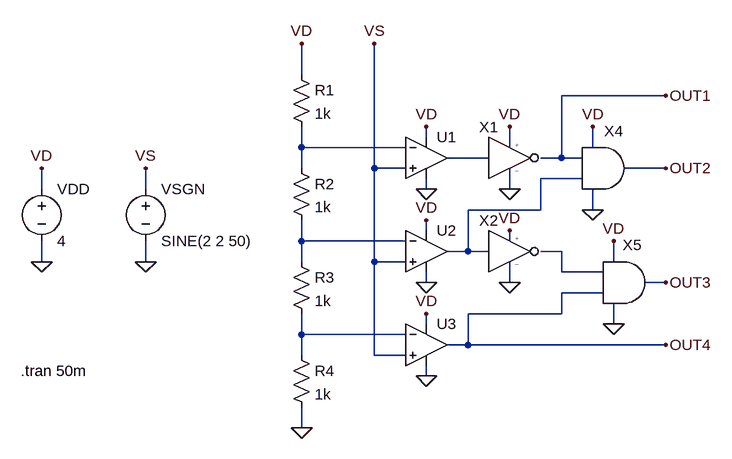
[diagram p0: schematic ADC_2b_Flash.asc]
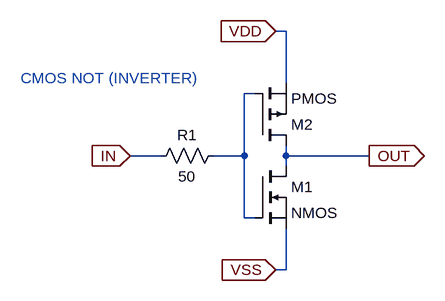
[diagram p1: sub-circuit not.asc]
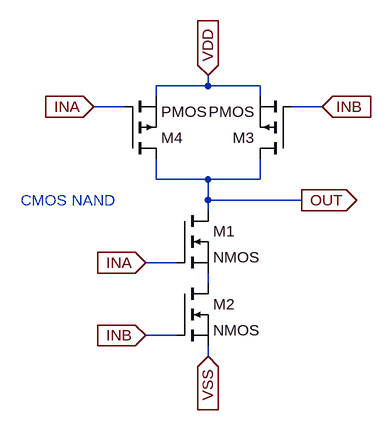
[diagram p2: sub-circuit nand.asc]
ADC_2b_Flash.asc, the LTspice schematic file:
Version 4
SHEET 1 1000 680
WIRE 112 96 112 48
WIRE 672 128 512 128
WIRE 304 192 304 176
WIRE 112 208 112 176
WIRE 272 208 112 208
WIRE 432 208 432 176
WIRE 560 208 560 176
WIRE 400 224 336 224
WIRE 512 224 512 128
WIRE 512 224 480 224
WIRE 544 224 512 224
WIRE 112 240 112 208
WIRE 224 240 224 48
WIRE 272 240 224 240
WIRE 672 240 608 240
WIRE 544 256 480 256
WIRE -288 272 -288 240
WIRE -128 272 -128 240
WIRE 304 272 304 256
WIRE 432 272 432 240
WIRE 480 304 480 256
WIRE 480 304 368 304
WIRE 560 304 560 272
WIRE 304 336 304 320
WIRE 112 352 112 320
WIRE 272 352 112 352
WIRE 432 352 432 336
WIRE 368 368 368 304
WIRE 368 368 336 368
WIRE 400 368 368 368
WIRE 512 368 480 368
WIRE -288 384 -288 352
WIRE -128 384 -128 352
WIRE 112 384 112 352
WIRE 224 384 224 240
WIRE 272 384 224 384
WIRE 592 384 592 352
WIRE 512 400 512 368
WIRE 576 400 512 400
WIRE 304 416 304 400
WIRE 432 416 432 384
WIRE 672 416 640 416
WIRE 576 432 512 432
WIRE 512 464 512 432
WIRE 512 464 368 464
WIRE 304 480 304 464
WIRE 592 480 592 448
WIRE 112 496 112 464
WIRE 272 496 112 496
WIRE 368 512 368 464
WIRE 368 512 336 512
WIRE 672 512 368 512
WIRE 112 528 112 496
WIRE 224 528 224 384
WIRE 272 528 224 528
WIRE 304 560 304 544
WIRE 112 640 112 608
FLAG 112 48 VD
FLAG 112 640 0
FLAG -288 240 VD
FLAG -128 240 VS
FLAG -288 384 0
FLAG -128 384 0
FLAG 672 240 OUT2
FLAG 672 128 OUT1
FLAG 672 512 OUT4
FLAG 672 416 OUT3
FLAG 224 48 VS
FLAG 304 176 VD
FLAG 304 320 VD
FLAG 304 464 VD
FLAG 304 272 0
FLAG 304 560 0
FLAG 304 416 0
FLAG 432 176 VD
FLAG 432 336 VD
FLAG 560 176 VD
FLAG 592 352 VD
FLAG 432 272 0
FLAG 432 416 0
FLAG 592 480 0
FLAG 560 304 0
SYMBOL res 96 80 R0
SYMATTR InstName R1
SYMATTR Value 1k
SYMBOL res 96 224 R0
SYMATTR InstName R2
SYMATTR Value 1k
SYMBOL res 96 368 R0
SYMATTR InstName R3
SYMATTR Value 1k
SYMBOL res 96 512 R0
SYMATTR InstName R4
SYMATTR Value 1k
SYMBOL voltage -128 256 R0
WINDOW 123 0 0 Left 0
WINDOW 39 0 0 Left 0
SYMATTR InstName VSGN
SYMATTR Value SINE(2 2 50)
SYMBOL voltage -288 256 R0
WINDOW 123 0 0 Left 0
WINDOW 39 0 0 Left 0
SYMATTR InstName VDD
SYMATTR Value 4
SYMBOL OpAmps\\UniversalOpamp2 304 224 R0
SYMATTR InstName U1
SYMBOL OpAmps\\UniversalOpamp2 304 368 R0
SYMATTR InstName U2
SYMBOL OpAmps\\UniversalOpamp2 304 512 R0
SYMATTR InstName U3
SYMBOL NOT 608 272 R0
SYMATTR InstName X1
SYMBOL NOT 608 416 R0
SYMATTR InstName X2
SYMBOL NAND 736 192 R0
WINDOW 0 -144 6 Bottom 2
SYMATTR InstName X4
SYMBOL NAND 768 368 R0
WINDOW 0 -147 6 Bottom 2
SYMATTR InstName X5
TEXT -320 552 Left 2 !.tran 50m

not.asc, the sub-circuit schematic file:
Version 4
SHEET 1 880 680
WIRE 288 -64 272 -64
WIRE 288 16 288 -64
WIRE 240 32 224 32
WIRE 96 128 48 128
WIRE 224 128 224 32
WIRE 224 128 176 128
WIRE 288 128 288 112
WIRE 416 128 288 128
WIRE 288 144 288 128
WIRE 224 224 224 128
WIRE 240 224 224 224
WIRE 288 304 288 240
WIRE 288 304 272 304
FLAG 48 128 IN
IOPIN 48 128 In
FLAG 272 304 VSS
IOPIN 272 304 In
FLAG 272 -64 VDD
IOPIN 272 -64 In
FLAG 416 128 OUT
IOPIN 416 128 Out
SYMBOL nmos 240 144 R0
SYMATTR InstName M1
SYMBOL pmos 240 112 M180
SYMATTR InstName M2
SYMBOL res 192 112 R90
WINDOW 0 0 56 VBottom 2
WINDOW 3 32 56 VTop 2
SYMATTR InstName R1
SYMATTR Value 50
TEXT -120 8 Left 2 ;CMOS NOT (INVERTER)

nand.asc, the sub-circuit schematic file:
Version 4
SHEET 1 880 680
WIRE 176 -48 176 -64
WIRE 176 -48 96 -48
WIRE 256 -48 176 -48
WIRE 96 -32 96 -48
WIRE 256 -32 256 -48
WIRE 48 -16 0 -16
WIRE 352 -16 304 -16
WIRE 96 96 96 64
WIRE 176 96 96 96
WIRE 256 96 256 64
WIRE 256 96 176 96
WIRE 176 128 176 96
WIRE 320 128 176 128
WIRE 176 144 176 128
WIRE 128 224 80 224
WIRE 176 256 176 240
WIRE 128 336 80 336
WIRE 176 368 176 352
FLAG 176 368 VSS
IOPIN 176 368 In
FLAG 176 -64 VDD
IOPIN 176 -64 In
FLAG 320 128 OUT
IOPIN 320 128 Out
FLAG 0 -16 INA
IOPIN 0 -16 In
FLAG 80 224 INA
IOPIN 80 224 In
FLAG 80 336 INB
IOPIN 80 336 In
FLAG 352 -16 INB
IOPIN 352 -16 In
SYMBOL nmos 128 144 R0
SYMATTR InstName M1
SYMBOL nmos 128 256 R0
SYMATTR InstName M2
SYMBOL pmos 304 64 R180
SYMATTR InstName M3
SYMBOL pmos 48 64 M180
SYMATTR InstName M4
TEXT -112 128 Left 2 ;CMOS NAND

The netlist it stands for:
* ADC_2b_Flash.asc
R1 VD N001 1k
R2 N001 N004 1k
R3 N004 N006 1k
R4 N006 0 1k
VSGN VS 0 SINE(2 2 50)
VDD VD 0 4
XU1 VS N001 VD 0 N002 level.2 Avol=1Meg GBW=10Meg Slew=10Meg ilimit=25m rail=0 Vos=0 phimargin=45 en=0 enk=0 in=0 ink=0 Rin=500Meg  ; pins IN+ IN- V+ V- OUT
XU2 VS N004 VD 0 N003 level.2 Avol=1Meg GBW=10Meg Slew=10Meg ilimit=25m rail=0 Vos=0 phimargin=45 en=0 enk=0 in=0 ink=0 Rin=500Meg  ; pins IN+ IN- V+ V- OUT
XU3 VS N006 VD 0 OUT4 level.2 Avol=1Meg GBW=10Meg Slew=10Meg ilimit=25m rail=0 Vos=0 phimargin=45 en=0 enk=0 in=0 ink=0 Rin=500Meg  ; pins IN+ IN- V+ V- OUT
XX1 N002 VD 0 OUT1 not
XX2 N003 VD 0 N005 not
XX4 OUT1 N003 VD 0 OUT2 nand
XX5 N005 OUT4 VD 0 OUT3 nand

* block symbol definitions
.subckt not IN VDD VSS OUT
M1 OUT N001 VSS VSS NMOS
M2 OUT N001 VDD VDD PMOS
R1 N001 IN 50
* CMOS NOT (INVERTER)
.ends not

.subckt nand INA INB VDD VSS OUT
M1 OUT INA N001 N001 NMOS
M2 N001 INB VSS VSS NMOS
M3 OUT INB VDD VDD PMOS
M4 OUT INA VDD VDD PMOS
* CMOS NAND
.ends nand

.model NMOS NMOS
.model PMOS PMOS
.lib standard.mos
.tran 50m
.lib UniversalOpamps2.sub
.backanno
.end